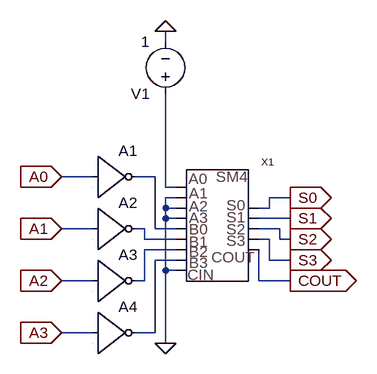
[diagram p0: schematic DopCode.asc]
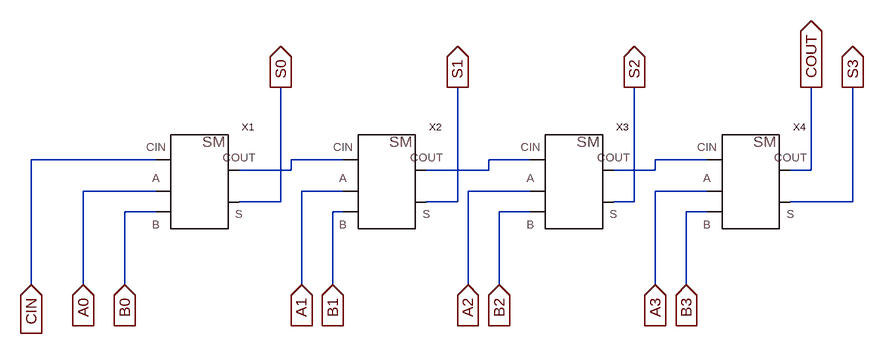
[diagram p1: sub-circuit sum4.asc]
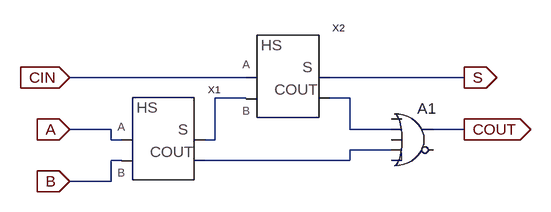
[diagram p2: sub-circuit fullsum.asc]
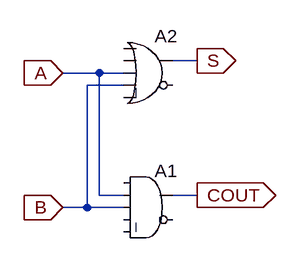
[diagram p3: sub-circuit halfsum.asc]
DopCode.asc, the LTspice schematic file:
Version 4
SHEET 1 880 680
WIRE 256 -128 256 -144
WIRE 144 80 96 80
WIRE 240 80 208 80
WIRE 256 96 256 -48
WIRE 272 96 256 96
WIRE 272 112 256 112
WIRE 448 112 416 112
WIRE 256 128 256 112
WIRE 272 128 256 128
WIRE 416 128 416 112
WIRE 416 128 400 128
WIRE 256 144 256 128
WIRE 272 144 256 144
WIRE 448 144 400 144
WIRE 144 160 96 160
WIRE 224 160 208 160
WIRE 240 160 240 80
WIRE 272 160 240 160
WIRE 432 160 400 160
WIRE 224 176 224 160
WIRE 272 176 224 176
WIRE 416 176 400 176
WIRE 432 176 432 160
WIRE 448 176 432 176
WIRE 272 192 224 192
WIRE 272 208 240 208
WIRE 416 208 416 176
WIRE 448 208 416 208
WIRE 256 224 256 144
WIRE 272 224 256 224
WIRE 144 240 96 240
WIRE 224 240 224 192
WIRE 224 240 208 240
WIRE 400 240 400 192
WIRE 448 240 400 240
WIRE 144 320 96 320
WIRE 240 320 240 208
WIRE 240 320 208 320
WIRE 256 336 256 224
FLAG 256 -144 0
FLAG 96 80 A0
IOPIN 96 80 In
FLAG 96 160 A1
IOPIN 96 160 In
FLAG 96 240 A2
IOPIN 96 240 In
FLAG 96 320 A3
IOPIN 96 320 In
FLAG 448 112 S0
IOPIN 448 112 Out
FLAG 448 144 S1
IOPIN 448 144 Out
FLAG 448 176 S2
IOPIN 448 176 Out
FLAG 448 208 S3
IOPIN 448 208 Out
FLAG 448 240 COUT
IOPIN 448 240 Out
FLAG 256 336 0
SYMBOL Digital\\inv 144 16 R0
SYMATTR InstName A1
SYMBOL Digital\\inv 144 96 R0
SYMATTR InstName A2
SYMBOL Digital\\inv 144 176 R0
SYMATTR InstName A3
SYMBOL Digital\\inv 144 256 R0
SYMATTR InstName A4
SYMBOL voltage 256 -32 R180
WINDOW 123 0 0 Left 2
WINDOW 39 0 0 Left 2
SYMATTR InstName V1
SYMATTR Value 1
SYMBOL SUM4 352 160 R0
SYMATTR InstName X1

sum4.asc, the sub-circuit schematic file:
Version 4
SHEET 1 1244 680
WIRE 96 128 -96 128
WIRE 384 128 304 128
WIRE 672 128 608 128
WIRE 944 128 864 128
WIRE 304 144 304 128
WIRE 304 144 224 144
WIRE 608 144 608 128
WIRE 608 144 512 144
WIRE 864 144 864 128
WIRE 864 144 800 144
WIRE 1104 144 1104 16
WIRE 1104 144 1072 144
WIRE 96 176 -16 176
WIRE 384 176 320 176
WIRE 672 176 576 176
WIRE 944 176 864 176
WIRE 288 192 288 16
WIRE 288 192 224 192
WIRE 560 192 560 16
WIRE 560 192 512 192
WIRE 832 192 832 16
WIRE 832 192 800 192
WIRE 1168 192 1168 16
WIRE 1168 192 1072 192
WIRE 96 208 48 208
WIRE 384 208 368 208
WIRE 672 208 624 208
WIRE 944 208 912 208
WIRE -96 320 -96 128
WIRE -16 320 -16 176
WIRE 48 320 48 208
WIRE 320 320 320 176
WIRE 368 320 368 208
WIRE 576 320 576 176
WIRE 624 320 624 208
WIRE 864 320 864 176
WIRE 912 320 912 208
FLAG -16 320 A0
IOPIN -16 320 In
FLAG 320 320 A1
IOPIN 320 320 In
FLAG 576 320 A2
IOPIN 576 320 In
FLAG 864 320 A3
IOPIN 864 320 In
FLAG -96 320 CIN
IOPIN -96 320 In
FLAG 48 320 B0
IOPIN 48 320 In
FLAG 368 320 B1
IOPIN 368 320 In
FLAG 624 320 B2
IOPIN 624 320 In
FLAG 912 320 B3
IOPIN 912 320 In
FLAG 288 16 S0
IOPIN 288 16 Out
FLAG 560 16 S1
IOPIN 560 16 Out
FLAG 832 16 S2
IOPIN 832 16 Out
FLAG 1104 16 COUT
IOPIN 1104 16 Out
FLAG 1168 16 S3
IOPIN 1168 16 Out
SYMBOL fullsum 160 160 R0
SYMATTR InstName X1
SYMBOL fullsum 448 160 R0
SYMATTR InstName X2
SYMBOL fullsum 736 160 R0
SYMATTR InstName X3
SYMBOL fullsum 1008 160 R0
SYMATTR InstName X4

fullsum.asc, the sub-circuit schematic file:
Version 4
SHEET 1 880 680
WIRE 400 64 128 64
WIRE 736 64 528 64
WIRE 400 96 352 96
WIRE 560 96 528 96
WIRE 192 144 128 144
WIRE 560 144 560 96
WIRE 624 144 560 144
WIRE 736 144 688 144
WIRE 192 160 192 144
WIRE 208 160 192 160
WIRE 352 160 352 96
WIRE 352 160 336 160
WIRE 624 176 560 176
WIRE 208 192 192 192
WIRE 560 192 560 176
WIRE 560 192 336 192
WIRE 192 224 192 192
WIRE 192 224 128 224
FLAG 128 144 A
IOPIN 128 144 In
FLAG 128 224 B
IOPIN 128 224 In
FLAG 128 64 CIN
IOPIN 128 64 In
FLAG 736 144 COUT
IOPIN 736 144 Out
FLAG 736 64 S
IOPIN 736 64 Out
SYMBOL halfsum 240 176 R0
SYMATTR InstName X1
SYMBOL halfsum 432 80 R0
SYMATTR InstName X2
SYMBOL Digital\\or 656 96 R0
SYMATTR InstName A1

halfsum.asc, the sub-circuit schematic file:
Version 4
SHEET 1 880 680
WIRE 272 -48 240 -48
WIRE 144 -32 96 -32
WIRE 176 -32 144 -32
WIRE 176 -16 128 -16
WIRE 144 128 144 -32
WIRE 176 128 144 128
WIRE 272 128 240 128
WIRE 128 144 128 -16
WIRE 128 144 96 144
WIRE 176 144 128 144
FLAG 96 -32 A
IOPIN 96 -32 In
FLAG 96 144 B
IOPIN 96 144 In
FLAG 272 -48 S
IOPIN 272 -48 Out
FLAG 272 128 COUT
IOPIN 272 128 Out
SYMBOL Digital\\and 208 80 R0
SYMATTR InstName A1
SYMBOL Digital\\or 208 -96 R0
SYMATTR InstName A2

The netlist it stands for:
* DopCode.asc
A1 A0 0 0 0 0 N001 0 0 BUF
A2 A1 0 0 0 0 N003 0 0 BUF
A3 A2 0 0 0 0 N004 0 0 BUF
A4 A3 0 0 0 0 N005 0 0 BUF
V1 N002 0 1
XX1 N002 0 0 0 0 S0 S1 S2 S3 COUT N001 N003 N004 N005 sum4

* block symbol definitions
.subckt sum4 A0 A1 A2 A3 CIN S0 S1 S2 S3 COUT B0 B1 B2 B3
XX1 CIN A0 B0 N001 S0 fullsum
XX2 N001 A1 B1 N002 S1 fullsum
XX3 N002 A2 B2 N003 S2 fullsum
XX4 N003 A3 B3 COUT S3 fullsum
.ends sum4

.subckt fullsum CIN A B COUT S
XX1 A B N001 N003 halfsum
XX2 CIN N001 S N002 halfsum
A1 0 N002 0 N003 0 0 COUT 0 OR
.ends fullsum

.subckt halfsum A B S COUT
A1 0 A B 0 0 0 COUT 0 AND
A2 0 0 A B 0 0 S 0 OR
.ends halfsum

.backanno
.end